# Altium schematic sheet motor_driver.SchDoc
size A4; Organization1: VINCULADA AO EXÉRCITO BRASILEIRO; Organization2: FÁBRICA DE MATERIAL DE; Organization3: COMUNICAÇÕES E ELETRÔNICA; Organization0: INDÚSTRIA DE MATERIAL BÉLICO DO BRASIL
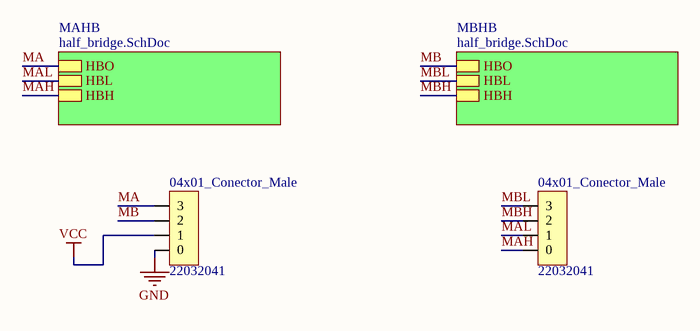
[diagram p0: motor_driver.SchDoc]

## Parts
(Parts that share a designator on the sheet are numbered #1, #2 ... from top to bottom, then left to right.)
04x01_Conector_Male#1  22032041  [04x01_Conector_Male]
04x01_Conector_Male#2  22032041  [04x01_Conector_Male]

## Sub-sheets
MAHB = half_bridge.SchDoc: HBO, HBL, HBH
MBHB = half_bridge.SchDoc: HBO, HBL, HBH

## Nets
GND: 04x01_Conector_Male#1.0
VCC: 04x01_Conector_Male#1.1
MA: 04x01_Conector_Male#1.3 ; sheet MAHB/HBO
MAH: 04x01_Conector_Male#2.0 ; sheet MAHB/HBH
MAL: 04x01_Conector_Male#2.1 ; sheet MAHB/HBL
MB: 04x01_Conector_Male#1.2 ; sheet MBHB/HBO
MBH: 04x01_Conector_Male#2.2 ; sheet MBHB/HBH
MBL: 04x01_Conector_Male#2.3 ; sheet MBHB/HBL

## Notes on the sheet
- USADO EQUIP.:
- DATA:
- ENG:
- HORA:
- APROV._______
- REV:
- TÍTULO:
- FOLHA:
- /
- FORMATO:
- A4
- CÓDIGO:
- ESTOQUE:

## Library data of the parts
04x01_Conector_Male#1 04x01_Conector_Male#2 = 04x01_Conector_Male-SCH: CONN HEADER 4POS .100 VERT TIN